# EAGLE design untitled (EAGLE 7.2.0)
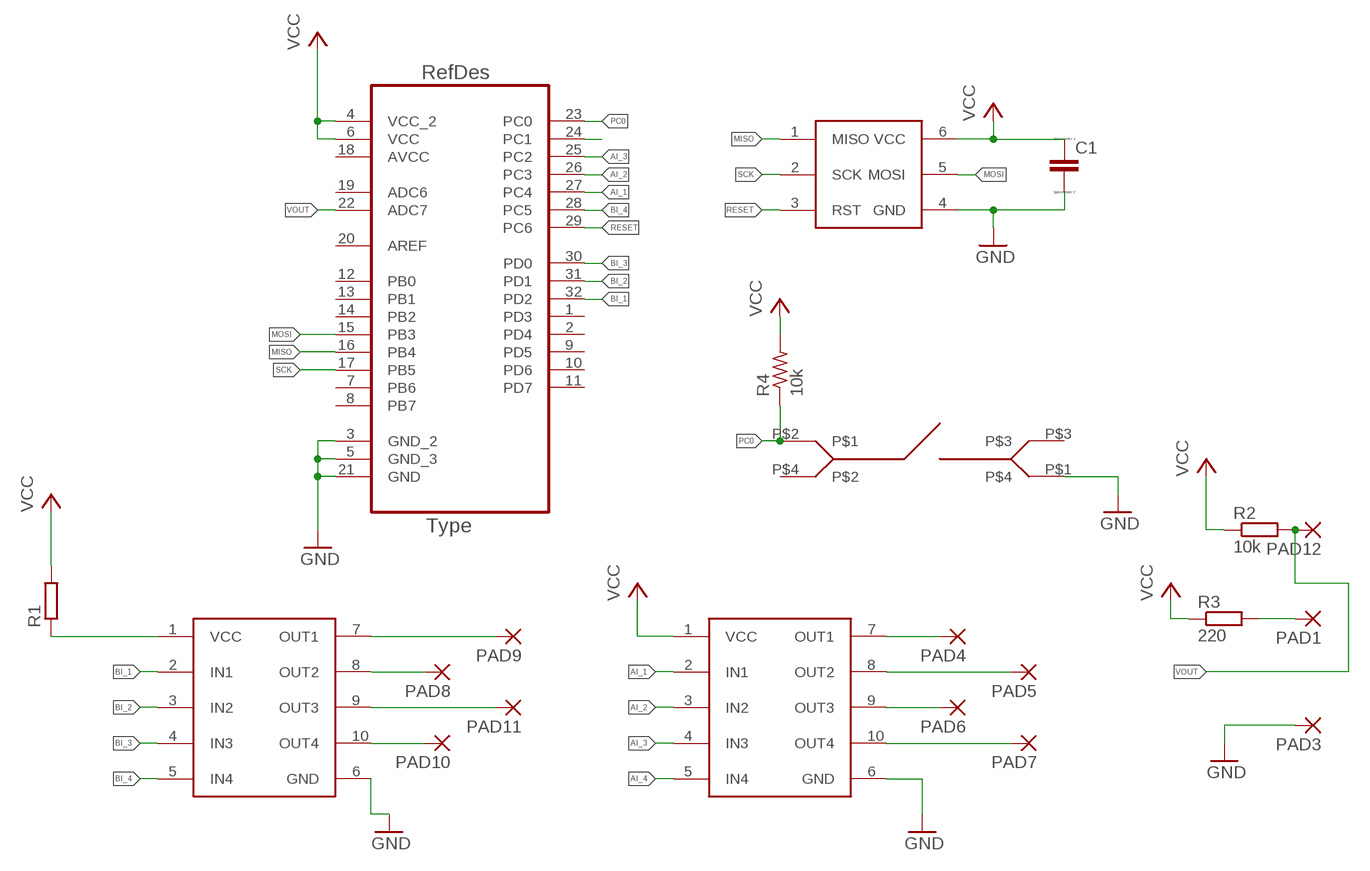
[diagram p0: schematic, sheet 1]

## Parts
C1  CC1206  [C1206]
PAD1  SMD2  [SMD1,27-2,54]
PAD3  SMD2  [SMD1,27-2,54]
PAD4  SMD2  [SMD1,27-2,54]
PAD5  SMD2  [SMD1,27-2,54]
PAD6  SMD2  [SMD1,27-2,54]
PAD7  SMD2  [SMD1,27-2,54]
PAD8  SMD2  [SMD1,27-2,54]
PAD9  SMD2  [SMD1,27-2,54]
PAD10  SMD2  [SMD1,27-2,54]
PAD11  SMD2  [SMD1,27-2,54]
PAD12  SMD2  [SMD1,27-2,54]
R1  R-EU_M1206  [M1206]
R2  10k  R-EU_M0805  [M0805]
R3  220  R-EU_M0805  [M0805]
R4  10k  R-US_M0805  [M0805]
U1  ATMEGA328P-AU  [QFP80P900X900X120-32N]
U$1  LB1948MC_STEP_DRIVE  [SOIC_10]
U$2  LB1948MC_STEP_DRIVE  [SOIC_10]
U$3  2X6_AVR_HEADER  [2X6_AVR_PIN_HEADER_SMD]
U$4  SMD_TACTILE_SWITCH  [SMD_TACTILE]

## Nets
AI_1: U1.27(PC4) U$2.2(IN1)
AI_2: U1.26(PC3) U$2.3(IN2)
AI_3: U1.25(PC2) U$2.4(IN3)
AI_4: U1.24(PC1) U$2.5(IN4)
BI_1: U1.32(PD2) U$1.2(IN1)
BI_2: U1.31(PD1) U$1.3(IN2)
BI_3: U1.30(PD0) U$1.4(IN3)
BI_4: U1.28(PC5) U$1.5(IN4)
GND: C1.2 PAD3.1(P) U1.3(GND_2) U1.5(GND_3) U1.21(GND) U$1.6(GND) U$2.6(GND) U$3.4(GND) U$4.P$1
MISO: U1.16(PB4) U$3.1(MISO)
MOSI: U1.15(PB3) U$3.5(MOSI)
N$1: PAD4.1(P) U$2.7(OUT1)
N$2: PAD5.1(P) U$2.8(OUT2)
N$3: PAD6.1(P) U$2.9(OUT3)
N$4: PAD7.1(P) U$2.10(OUT4)
N$5: PAD9.1(P) U$1.7(OUT1)
N$6: PAD8.1(P) U$1.8(OUT2)
N$7: PAD11.1(P) U$1.9(OUT3)
N$8: PAD10.1(P) U$1.10(OUT4)
N$9: R1.1 U$1.1(VCC)
N$11: PAD1.1(P) R3.2
PC0: R4.1 U1.23(PC0) U$4.P$2
RESET: U1.29(PC6) U$3.3(RST)
SCK: U1.17(PB5) U$3.2(SCK)
VCC: C1.1 R1.2 R2.1 R3.1 R4.2 U1.4(VCC_2) U1.6(VCC) U$2.1(VCC) U$3.6(VCC)
VOUT: PAD12.1(P) R2.2 U1.22(ADC7)
Unconnected: U1.1(PD3) U1.2(PD4) U1.7(PB6) U1.8(PB7) U1.9(PD5) U1.10(PD6) U1.11(PD7) U1.12(PB0) U1.13(PB1) U1.14(PB2) U1.19(ADC6) U1.20(AREF) U$4.P$3 U$4.P$4

## Power pins joined to a net without a drawn wire
AVCC: U1.18(AVCC)

## Library data of the parts
C1 = eagle-ltspice:C: CAPACITOR, European symbol; SPICEMODEL: NONE; SPICEPREFIX: C
PAD1 PAD3-PAD12 = wirepad:SMD2: SMD PAD
R1-R3 = rcl:R-EU_: RESISTOR, European symbol
R4 = adafruit:R-US_: RESISTOR, American symbol
U1 = Atmel-ATMEGA328P-AU:ATMEGA328P-AU; DESCRIPTION: 8-bit Microcontroller with In-System Programmable Flash; MPN: ATMEGA328P-AU; OC_FARNELL: 1715486; OC_NEWARK: 14R4631; PACKAGE: TQFP-32; SUPPLIER: Atmel
U$1 U$2 = farnell_parts:LB1948MC_STEP_DRIVE
U$3 = farnell_parts:2X6_AVR_HEADER
U$4 = farnell_parts:SMD_TACTILE_SWITCH

## Board
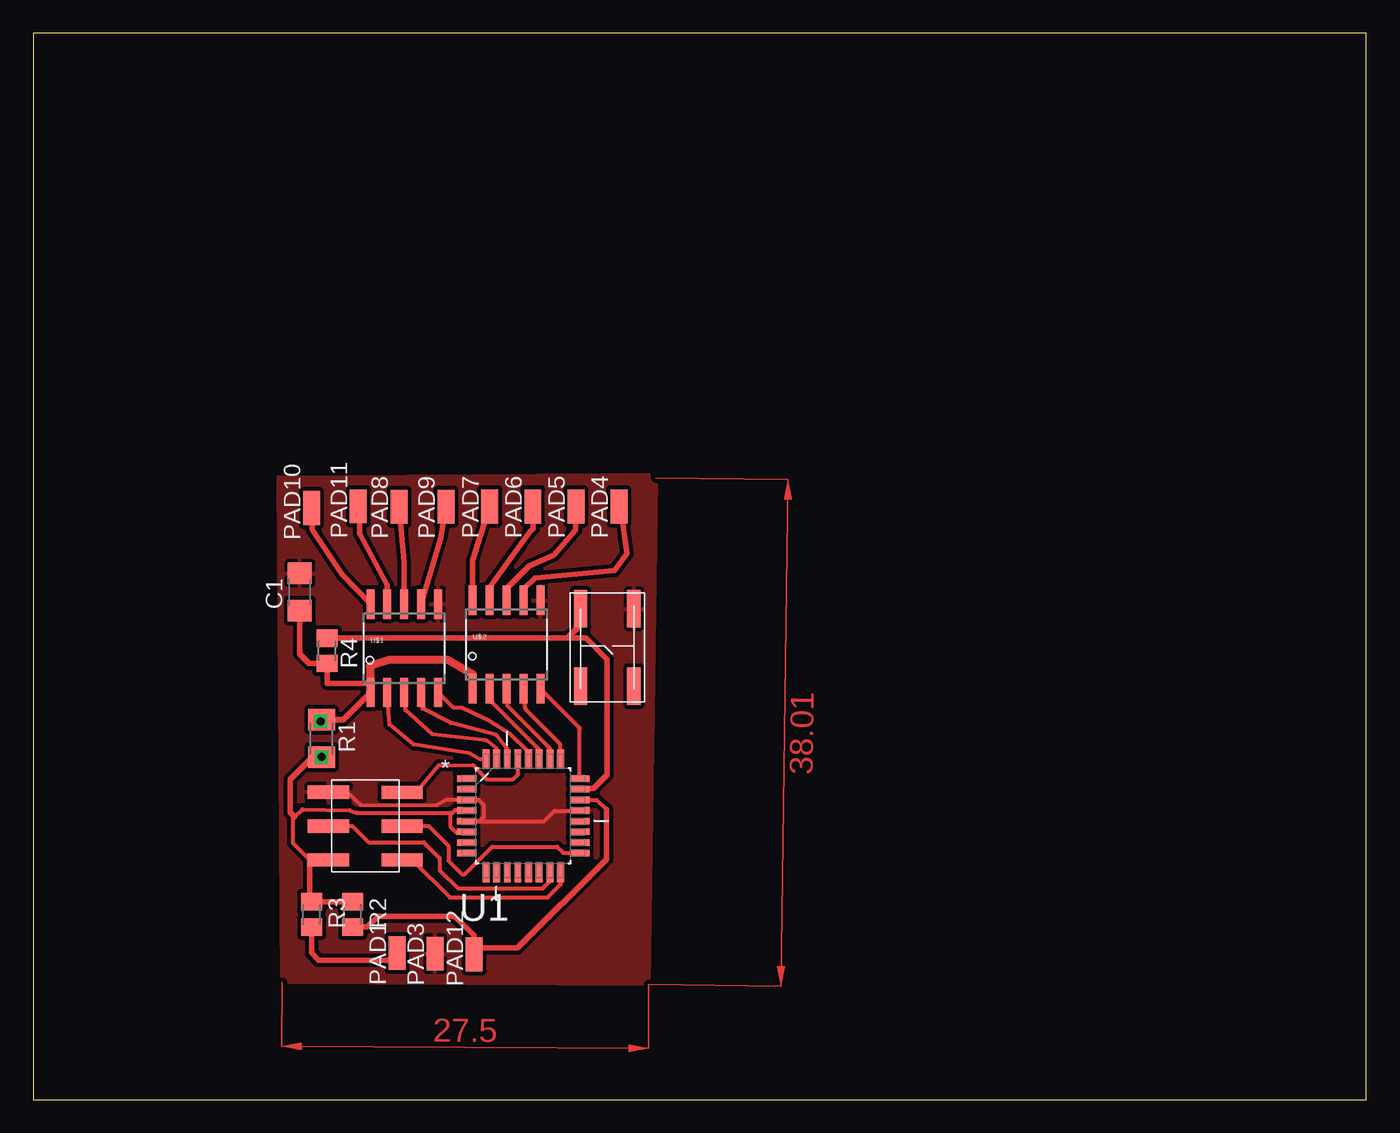
[diagram p1: board, top side]
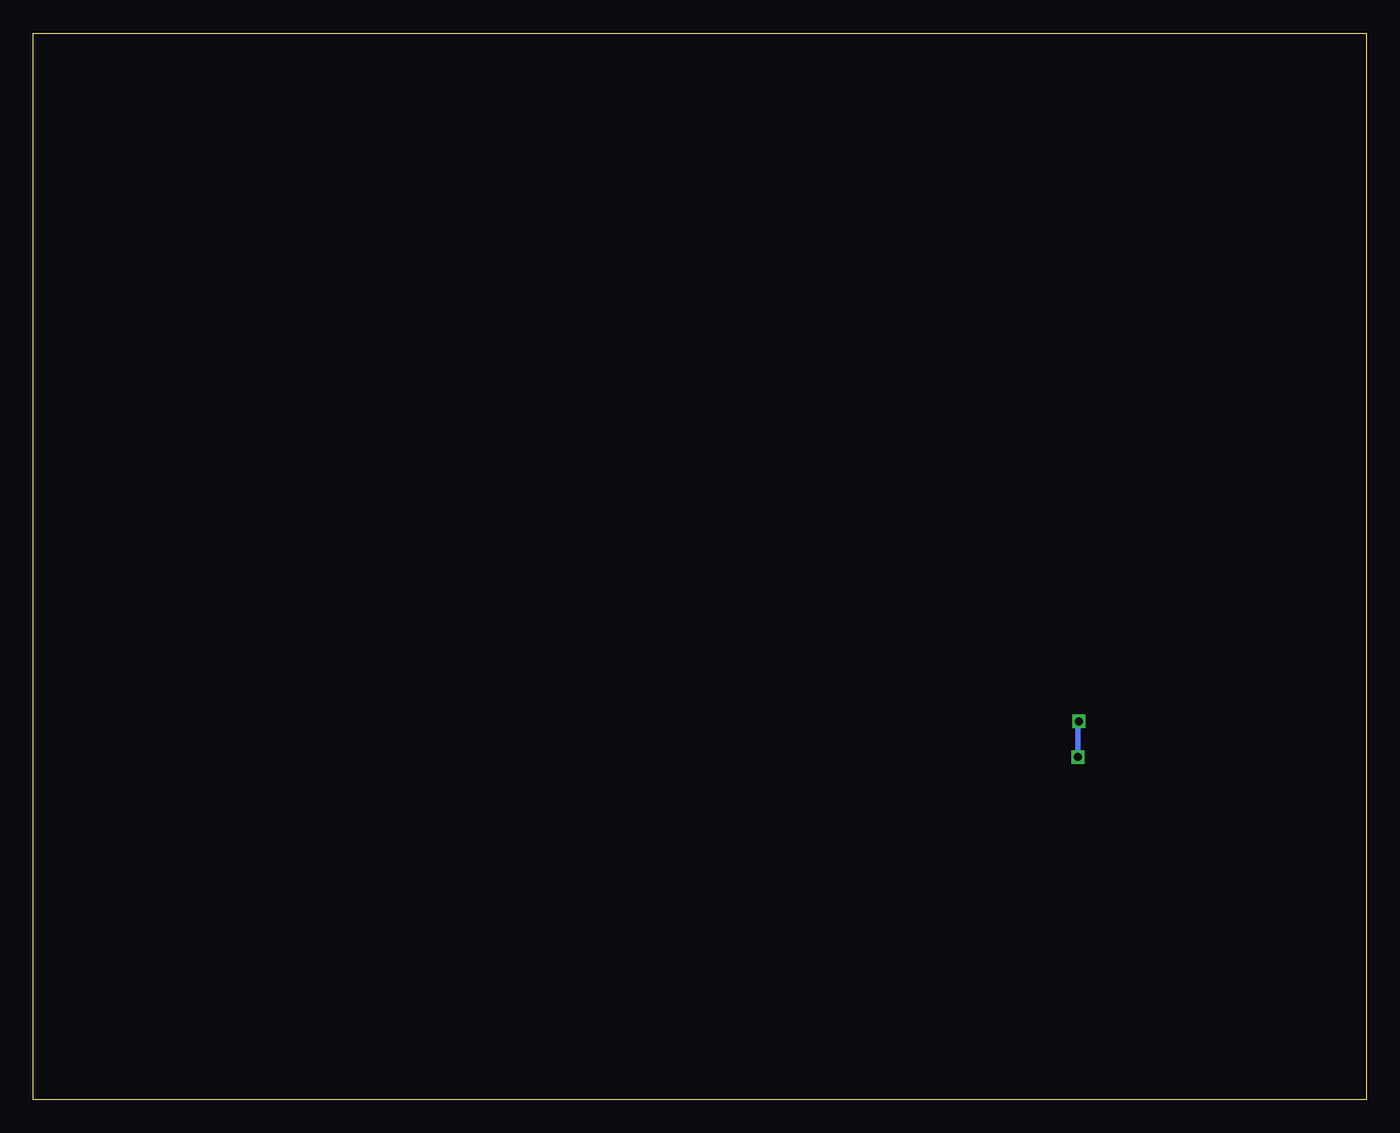
[diagram p2: board, bottom side, seen from below]

Size 100 x 80 mm. Coordinates in mm from the lower left corner, seen from the top.
Outline: 0,0 100,0 100,80 0,80 0,0
Copper layers (1*16): Top 0.035mm / dielectric 1.5mm / Bottom 0.035mm
Design rules "default": minimum track width 10mil, minimum drill 24mil, track to track 8mil, track to pad 8mil, pad to pad 8mil, via to via 8mil, smd to smd 8mil, copper to edge 40mil, drill to drill 8mil, minimum pad ring 10mil, minimum via ring 8mil, stop-mask expansion 4mil, vias tented up to drill 0mil, thermal gap 10mil

### Footprints (pad centres in the part's own frame; a part is rotated, then mirrored left to right if it is on the bottom)
C1206 = smd 1.6 x 1.8: 1 -1.4,0; 2 1.4,0
SMD1,27-2,54 = smd 1.27 x 2.54: 1 0,0
M1206 = smd 1.6 x 2: 1 -1.4,0; 2 1.4,0
M0805 = smd 1.3 x 1.6: 1 -0.95,0; 2 0.95,0
QFP80P900X900X120-32N = smd 1.473 x 0.508: 1 -4.242,2.794; 2 -4.242,2.007; 3 -4.242,1.194; 4 -4.242,0.406; 5 -4.242,-0.406; 6 -4.242,-1.194; 7 -4.242,-2.007; 8 -4.242,-2.794; 17 4.242,-2.794; 18 4.242,-2.007; 19 4.242,-1.194; 20 4.242,-0.406; 21 4.242,0.406; 22 4.242,1.194; 23 4.242,2.007; 24 4.242,2.794 | smd 0.508 x 1.473: 9 -2.794,-4.242; 10 -2.007,-4.242; 11 -1.194,-4.242; 12 -0.406,-4.242; 13 0.406,-4.242; 14 1.194,-4.242; 15 2.007,-4.242; 16 2.794,-4.242; 25 2.794,4.242; 26 2.007,4.242; 27 1.194,4.242; 28 0.406,4.242; 29 -0.406,4.242; 30 -1.194,4.242; 31 -2.007,4.242; 32 -2.794,4.242
SOIC_10 = smd 0.6 x 2.2: 1 -1.905,-3.315; 2 -0.635,-3.315; 3 0.635,-3.315; 4 1.905,-3.315; 5 3.175,-3.315; 6 3.175,3.315; 7 1.905,3.315; 8 0.635,3.315; 9 -0.635,3.315; 10 -1.905,3.315
2X6_AVR_PIN_HEADER_SMD = smd 1 x 3.1: 1 0,-5.52; 2 2.53,-5.52; 3 5.06,-5.52; 4 5.08,0; 5 2.54,0; 6 0,0
SMD_TACTILE = smd 2.8 x 1: P$1 0,0; P$2 0,-4; P$3 5.8,0; P$4 5.8,-4

### Placement (x,y rotation side)
C1  19.99,38.08 90 top
PAD1  27.29,10.99 0 top
PAD3  30.14,10.95 0 top
PAD4  43.94,44.51 0 top
PAD5  40.71,44.51 0 top
PAD6  37.48,44.51 0 top
PAD7  34.25,44.51 0 top
PAD8  27.44,44.48 0 top
PAD9  30.95,44.48 0 top
PAD10  20.87,44.38 0 top
PAD11  24.38,44.51 0 top
PAD12  33.08,10.9 0 top
R1  21.63,27.09 270 top
R2  23.96,13.89 270 top
R3  20.88,13.89 270 top
R4  22.04,33.67 270 top
U1  36.75,21.29 0 top
U$1  27.2,33.86 0 top
U$2  34.87,34.14 0 top
U$3  22.14,17.98 90 top
U$4  45.06,36.82 270 top

### Tracks (layer width: path | path; a pad name or v marks a point on that pad's centre or on a via)
AI_1
  Top 0.305: U1.27 37.95,26.26 34.29,29.92 34.29,30.77 U$2.2
AI_2
  Top 0.305: U1.26 38.76,26.36 35.58,29.54 35.58,30.75 U$2.3
AI_3
  Top 0.305: U1.25 39.55,26.64 36.93,29.25 36.93,29.32 36.9,29.35 36.9,30.69 U$2.4
AI_4
  Top 0.305: U1.24 41,27.87 U$2.5
BI_1
  Top 0.305: U1.32 33.56,25.53 32.78,25.96 28.54,26.64 26.73,28.14 26.54,30.51 U$1.2
BI_2
  Top 0.305: U1.31 34.75,26.35 33.99,26.94 29.95,27.4 27.91,29.23 27.91,30.46 U$1.3
BI_3
  Top 0.305: U1.30 35.56,26.34 34.74,27.34 31.34,28.24 29.2,29.33 29.2,30.44 U$1.4
BI_4
  Top 0.305: U1.28 37.16,26.1 35.78,27.42 34.23,28.42 32.18,29.38 31.53,29.38 U$1.5
GND
  Top 0.305: U$3.4 23.44,23.14 24.57,22.09 30.25,22.09 31.04,22.52 32.48,22.52 U1.3 33.41,22.48 33.79,22.1 33.79,21.2 33.45,20.86 32.54,20.86 U1.5 38.33,20.88 39.11,21.67 40.97,21.67 U1.21
  pour Top (isolate 0.305): 18.39,46.69 47.37,46.88 46.72,46.65 46.17,8.64 18.67,8.79
MISO
  Top 0.305: U$3.1 28.43,17.98 31.26,15.15 38.59,15.15 39.57,16.14 39.57,17.02 U1.16
MOSI
  Top 0.305: U$3.5 23.93,20.52 25.14,19.31 29.3,19.31 30.5,18.11 30.5,17.21 31.88,15.83 38.22,15.83 38.83,16.44 38.83,16.98 U1.15
N$1
  Top 0.406: U$2.7 36.77,38.29 37.63,39.14 43.61,39.68 44.55,40.97 44.04,44.4 PAD4.1
N$2
  Top 0.406: U$2.8 35.5,38.34 37.19,40.02 39.07,40.84 40.67,42.73 40.67,44.47 PAD5.1
N$3
  Top 0.406: U$2.9 34.23,38.43 36.55,41.66 37.27,42.6 37.49,42.83 37.49,44.49 PAD6.1
N$4
  Top 0.406: U$2.10 32.96,40.45 PAD7.1
N$5
  Top 0.406: U$1.7 30.55,42.1 PAD9.1
N$6
  Top 0.406: U$1.8 27.83,40.34 PAD8.1
N$7
  Top 0.406: U$1.9 26.56,38.62 24.5,42.48 24.5,42.83 24.49,42.59 24.49,44.4 PAD11.1
N$8
  Top 0.406: U$1.10 23.16,39.41 20.93,42.78 20.93,44.32 PAD10.1
N$9
  Top 0.406: R1.1 23.24,28.5 U$1.1
N$11
  Top 0.406: R3.2 20.88,11 21.42,10.46 26.76,10.46 PAD1.1
PC0
  Top 0.406: R4.1 40.08,34.62 | 40.08,34.62 41.11,35.65 41.11,36.77 U$4.P$2 | 40.08,34.62 41.45,34.62 43.05,33.01 43.05,24.36 42.03,23.33 41.03,23.33 U1.23
RESET
  Top 0.305: U$3.3 28.7,23.04 30.42,25.07 32.99,25.11 34.01,24.03 36.01,24.03 36.37,24.4 36.37,25.5 U1.29
SCK
  Top 0.305: U$3.2 29.68,20.51 31.15,19.04 31.15,17.91 32.15,16.91 32.37,16.91 34.43,18.96 39.31,18.96 39.77,18.5 40.99,18.5 U1.17
VCC  (via drill 0.6)
  Top 0.305: U1.4 31.64,21.7 31.28,21.33 | 31.28,21.33 31.28,20.5 31.75,20.02 32.44,20.02 U1.6 | U$3.6 20.72,17.98 19.48,19.22 19.48,21.06 19.62,21.19 20.2,21.78 23.75,21.7 24.25,21.51 31.29,21.51 31.28,21.33
  Top 0.406: 19.62,21.19 19.26,21.55 19.26,24.01 20.95,25.7 R1.2 | 25.26,30.57 25.23,30.57 25.23,30.28 25.05,30.28 23.28,28.51 21.69,28.51 v21.56,28.38 | 25.26,31.21 22.05,31.21 R4.2 20.7,32.71 19.99,33.41 C1.1 | 20.72,17.98 20.72,14.92 20.79,14.84 R3.1 R2.1
  Top 0.61: U$2.1 32.96,31.9 31.08,32.99 26.72,32.99 25.26,32.53 25.26,31.21 25.26,30.57
  Bottom 0.406: v21.56,28.38 21.63,28.31 R1.2
  other vias: 21.63,25.69
VOUT
  Top 0.305: 43,21.75 42.29,22.46 41.02,22.46 U1.22
  Top 0.406: R2.2 25.03,12.94 25.85,13.76 31.62,13.76 33.07,12.32 33.07,10.91 PAD12.1 33.56,11.37 36.34,11.37 43,18.03 43,21.75
(copper drawn outside any net)
  shapes: Top area x2